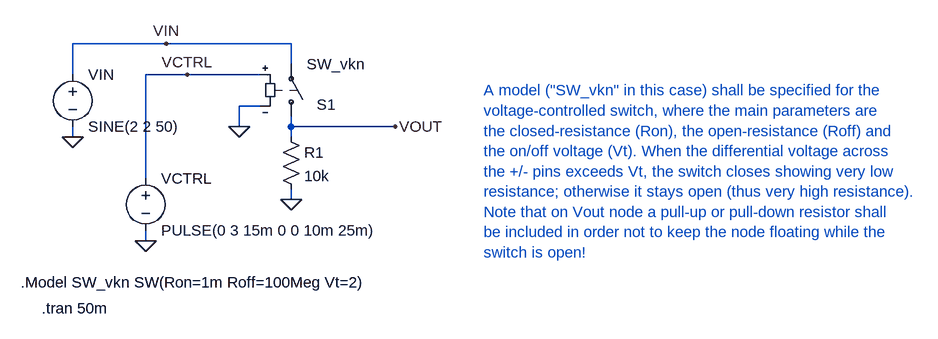
[diagram p0: schematic __Voltage_Controlled_Switch.asc]
__Voltage_Controlled_Switch.asc, the LTspice schematic file:
Version 4
SHEET 1 1556 688
WIRE 16 96 -128 96
WIRE 208 96 16 96
WIRE 208 128 208 96
WIRE -128 144 -128 96
WIRE 48 144 -16 144
WIRE 160 144 48 144
WIRE 160 192 128 192
WIRE 128 224 128 192
WIRE 208 224 208 208
WIRE 368 224 208 224
WIRE -128 240 -128 224
WIRE 208 240 208 224
WIRE -16 304 -16 144
WIRE 208 336 208 320
WIRE -16 400 -16 384
FLAG -16 400 0
FLAG -128 240 0
FLAG 208 336 0
FLAG 128 224 0
FLAG 368 224 VOUT
FLAG 16 96 VIN
FLAG 48 144 VCTRL
SYMBOL sw 208 224 M180
WINDOW 0 39 34 Left 2
SYMATTR InstName S1
SYMATTR Value SW_vkn
SYMBOL res 192 224 R0
SYMATTR InstName R1
SYMATTR Value 10k
SYMBOL voltage -16 288 R0
WINDOW 123 0 0 Left 0
WINDOW 39 0 0 Left 0
SYMATTR InstName VCTRL
SYMATTR Value PULSE(0 3 15m 0 0 10m 25m)
SYMBOL voltage -128 128 R0
WINDOW 123 0 0 Left 0
WINDOW 39 0 0 Left 0
SYMATTR InstName VIN
SYMATTR Value SINE(2 2 50)
TEXT -176 504 Left 2 !.tran 50m
TEXT -208 464 Left 2 !.Model SW_vkn SW(Ron=1m Roff=100Meg Vt=2)
TEXT 504 168 Left 2 ;A model ("SW_vkn" in this case) shall be specified for the\nvoltage-controlled switch, where the main parameters are\nthe closed-resistance (Ron), the open-resistance (Roff) and\nthe on/off voltage (Vt). When the differential voltage across\nthe +/- pins exceeds Vt, the switch closes showing very low\nresistance; otherwise it stays open (thus very high resistance).\nNote that on Vout node a pull-up or pull-down resistor shall\nbe included in order not to keep the node floating while the\nswitch is open!

The netlist it stands for:
* __Voltage_Controlled_Switch.asc
S1 VOUT VIN VCTRL 0 SW_vkn
R1 VOUT 0 10k
VCTRL VCTRL 0 PULSE(0 3 15m 0 0 10m 25m)
VIN VIN 0 SINE(2 2 50)
.tran 50m
.Model SW_vkn SW(Ron=1m Roff=100Meg Vt=2)
* A model ("SW_vkn" in this case) shall be specified for the
* voltage-controlled switch, where the main parameters are
* the closed-resistance (Ron), the open-resistance (Roff) and
* the on/off voltage (Vt). When the differential voltage across
* the +/- pins exceeds Vt, the switch closes showing very low
* resistance; otherwise it stays open (thus very high resistance).
* Note that on Vout node a pull-up or pull-down resistor shall
* be included in order not to keep the node floating while the
* switch is open!
.backanno
.end